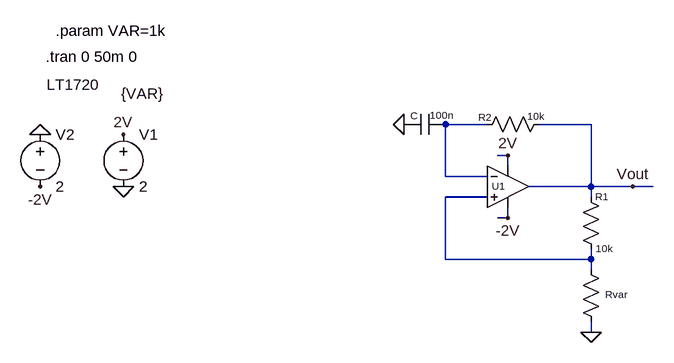
[diagram p0: schematic Square Oscillator -PWM- Astable Multivibrator.asc]
Square Oscillator -PWM- Astable Multivibrator.asc, the LTspice schematic file:
Version 4
SHEET 1 880 680
WIRE 144 112 80 112
WIRE 304 112 224 112
WIRE 176 160 160 160
WIRE 176 176 176 160
WIRE 80 192 80 112
WIRE 144 192 80 192
WIRE 304 208 304 112
WIRE 304 208 208 208
WIRE 368 208 304 208
WIRE 400 208 368 208
WIRE 144 224 80 224
WIRE 304 224 304 208
WIRE 176 256 176 240
WIRE 176 256 160 256
WIRE 80 320 80 224
WIRE 304 320 304 304
WIRE 304 320 80 320
WIRE 304 336 304 320
WIRE 304 432 304 416
FLAG 176 160 2V
FLAG 368 208 Vout
FLAG 304 432 0
FLAG 16 112 0
FLAG -416 128 2V
FLAG -416 208 0
FLAG -544 208 -2V
FLAG -544 128 0
FLAG 176 256 -2V
SYMBOL res 320 320 R180
WINDOW 0 -11 97 Left 1
WINDOW 3 -17 17 Left 1
SYMATTR InstName R1
SYMATTR Value 10k
SYMBOL res 320 432 R180
WINDOW 0 -40 58 Left 1
WINDOW 3 674 367 Left 2
SYMATTR InstName Rvar
SYMATTR Value {VAR}
SYMBOL res 240 96 R90
WINDOW 0 15 99 VBottom 1
WINDOW 3 -7 21 VTop 1
SYMATTR InstName R2
SYMATTR Value 10k
SYMBOL cap 80 96 R90
WINDOW 0 13 48 VBottom 1
WINDOW 3 -9 6 VTop 1
SYMATTR InstName C
SYMATTR Value 100n
SYMBOL voltage -416 112 R0
WINDOW 123 0 0 Left 0
WINDOW 39 0 0 Left 0
SYMATTR InstName V1
SYMATTR Value 2
SYMBOL voltage -544 112 R0
WINDOW 123 0 0 Left 0
WINDOW 39 0 0 Left 0
SYMATTR InstName V2
SYMATTR Value 2
SYMBOL Comparators\\LT1720 176 144 R0
WINDOW 0 -25 63 Left 1
WINDOW 3 -710 -93 Left 2
SYMATTR InstName U1
TEXT -536 8 Left 2 !.tran 0 50m 0
TEXT -520 -32 Left 2 !.param VAR=1k

The netlist it stands for:
* Square Oscillator -PWM- Astable Multivibrator.asc
R1 N002 Vout 10k
Rvar 0 N002 {VAR}
R2 Vout N001 10k
C N001 0 100n
V1 2V 0 2
V2 0 -2V 2
XU1 N002 N001 2V -2V Vout LT1720  ; pins In+ In- V+ V- OUT
.tran 0 50m 0
.param VAR=1k
.lib LT1720.sub
.backanno
.end